# EAGLE design shematic (EAGLE 6.4)
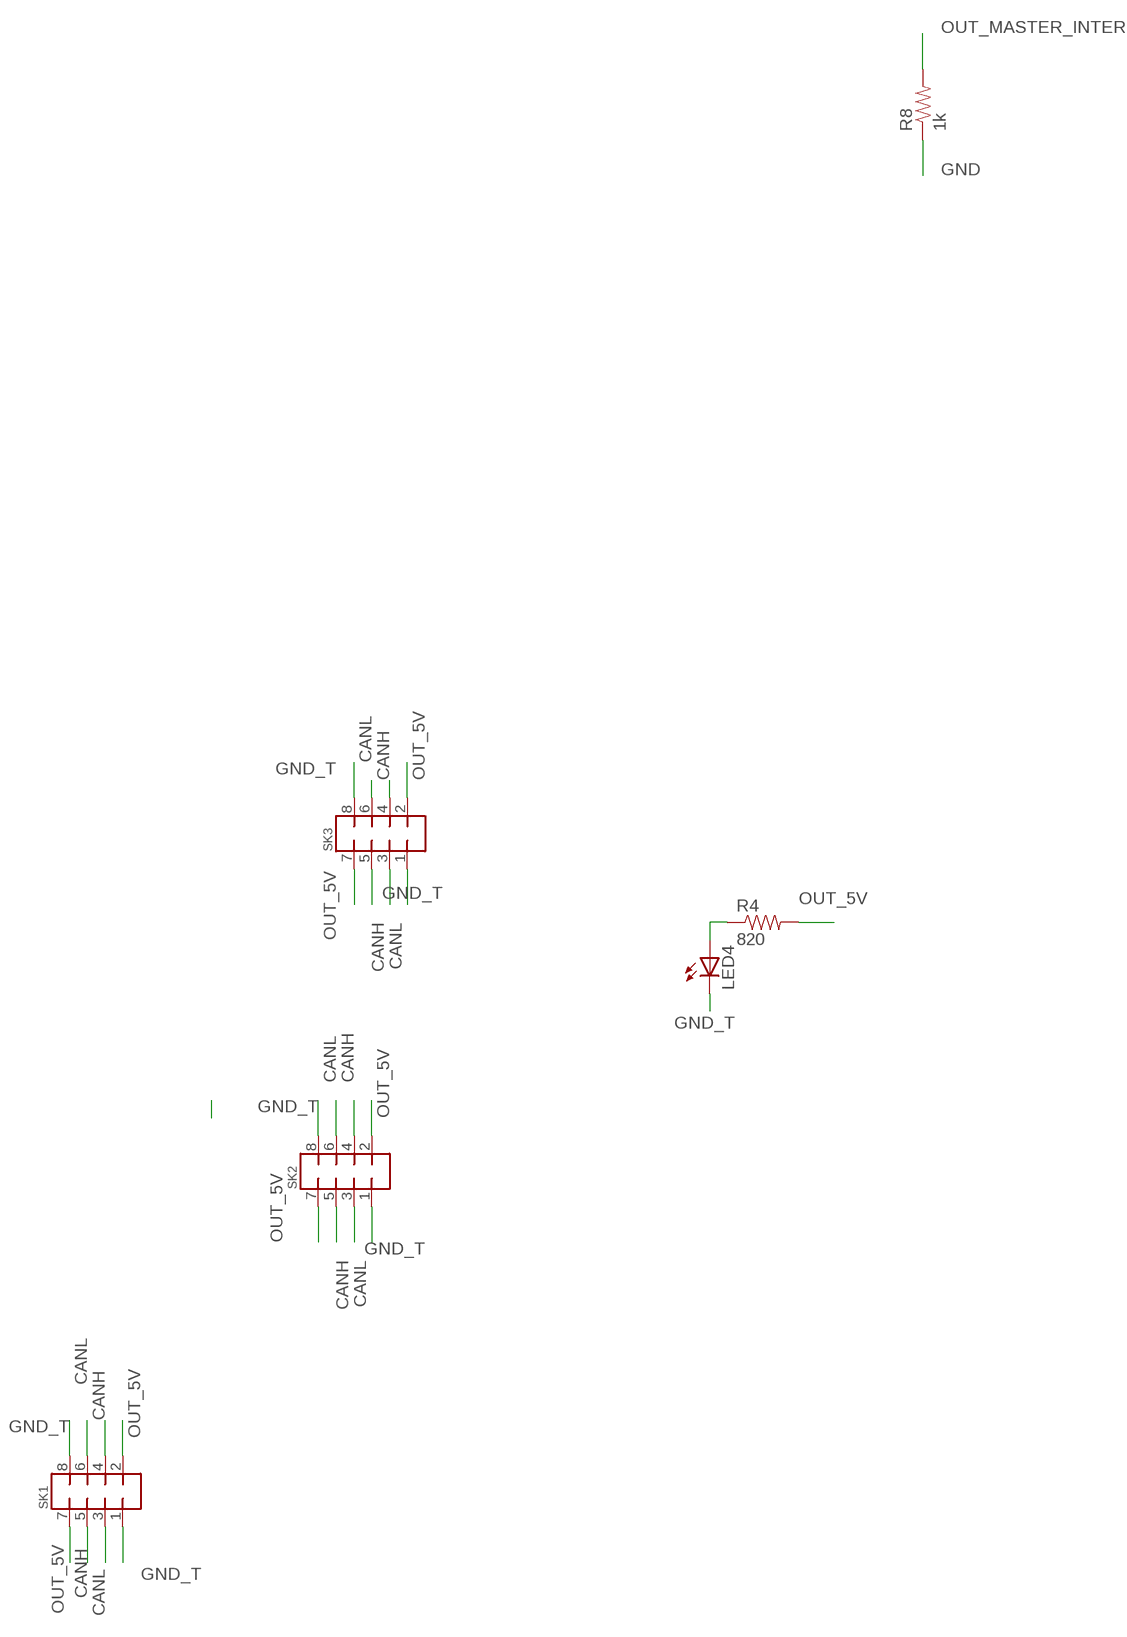
[diagram p0: schematic, sheet 1, part 1 of 2]
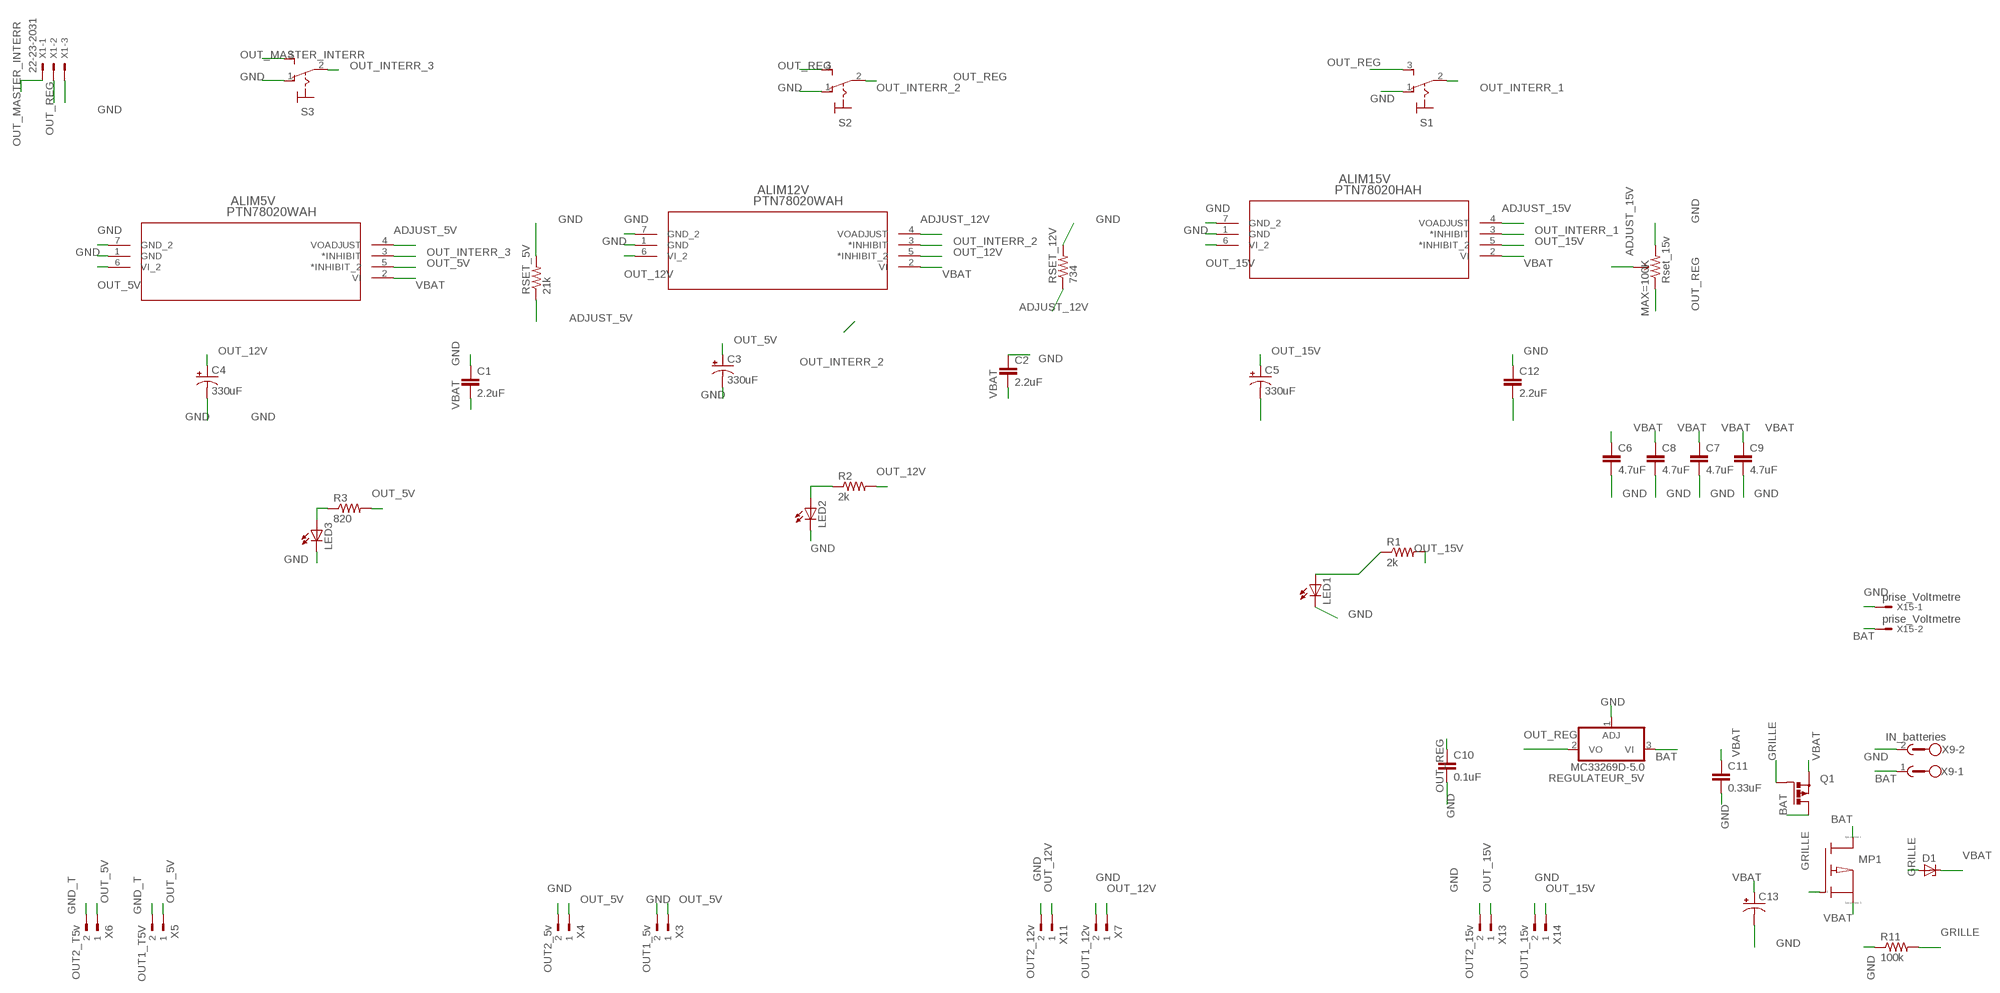
[diagram p1: schematic, sheet 1, part 2 of 2]

## Parts
ALIM5V  PTN78020WAH  PTN78020_  [EUK7]
ALIM12V  PTN78020WAH  PTN78020_  [EUK7]
ALIM15V  PTN78020HAH  PTN78020_  [EUK7]
C1  2.2uF  CAP0805  [0805]
C2  2.2uF  CAP0805  [0805]
C3  330uF  CAP_POLPTH1  [CPOL-RADIAL-100UF-25V]
C4  330uF  CAP_POLPTH1  [CPOL-RADIAL-100UF-25V]
C5  330uF  CAP_POLPTH1  [CPOL-RADIAL-100UF-25V]
C6  4.7uF  CAP0805  [0805]
C7  4.7uF  CAP0805  [0805]
C8  4.7uF  CAP0805  [0805]
C9  4.7uF  CAP0805  [0805]
C10  0.1uF  CAP0805  [0805]
C11  0.33uF  CAP0805  [0805]
C12  2.2uF  CAP0805  [0805]
C13  CAP_POLPTH1  [CPOL-RADIAL-100UF-25V]
D1  ZENER-DIODESOT23  [SOT23]
LED1  LEDCHIP-LED0805  [CHIP-LED0805]
LED2  LEDCHIP-LED0805  [CHIP-LED0805]
LED3  LEDCHIP-LED0805  [CHIP-LED0805]
LED4  LEDCHIP-LED0805  [CHIP-LED0805]
MAX=100K  Rset_15v  TRIMPOT-PTH-KNOB  [3386U]
MP1  PMOS  [SOT23]
Q1  PMOSFET_PTO220BH  [TO220BH]
R1  2k  RESISTOR0805-RES  [0805]
R2  2k  RESISTOR0805-RES  [0805]
R3  820  RESISTOR0805-RES  [0805]
R4  820  RESISTOR0805-RES  [0805]
R8  1k  RESISTOR0805-RES  [0805]
R11  100k  RESISTOR0805-RES  [0805]
REGULATEUR_5V  MC33269D-5.0  [DPACK]
RSET_5V  21k  RESISTOR0805-RES  [0805]
RSET_12V  734  RESISTOR0805-RES  [0805]
S1  M9040P  [M9040P]
S2  M9040P  [M9040P]
S3  M9040P  [M9040P]
SK1  MMATCH-8-PTH  [AMP-215079-8]
SK2  MMATCH-8-PTH  [AMP-215079-8]
SK3  MMATCH-8-PTH  [AMP-215079-8]
X1  22-23-2031  [22-23-2031]
X3  OUT1_5v  90-2  [90-2]
X4  OUT2_5v  90-2  [90-2]
X5  OUT1_T5V  90-2  [90-2]
X6  OUT2_T5v  90-2  [90-2]
X7  OUT1_12v  90-2  [90-2]
X9  IN_batteries  GMSTBA2  [GMSTBA2]
X11  OUT2_12v  90-2  [90-2]
X13  OUT2_15v  90-2  [90-2]
X14  OUT1_15v  90-2  [90-2]
X15  prise_Voltmetre  KK-156-2  [KK-156-2]

## Nets
ADJUST_5V: ALIM5V.4(VOADJUST) RSET_5V.1
ADJUST_12V: ALIM12V.4(VOADJUST) RSET_12V.1
ADJUST_15V: ALIM15V.4(VOADJUST) MAX=100K.2(WIPER)
BAT: MP1.3(D) Q1.D REGULATEUR_5V.3(VI) X9.1 X15.2
CANH: SK1.4 SK1.5 SK2.4 SK2.5 SK3.4 SK3.5
CANL: SK1.3 SK1.6 SK2.3 SK2.6 SK3.3 SK3.6
GND: ALIM5V.1(GND) ALIM5V.7(GND_2) ALIM12V.1(GND) ALIM12V.7(GND_2) ALIM15V.1(GND) ALIM15V.7(GND_2) C1.1 C2.1 C3.2(-) C4.2(-) C5.2(-) C6.2 C7.2 C8.2 C9.2 C10.2 C11.2 C12.1 C13.2(-) LED1.C LED2.C LED3.C MAX=100K.3(CW) R8.1 R11.1 REGULATEUR_5V.1(ADJ) RSET_5V.2 RSET_12V.2 S1.1(O) S2.1(O) S3.1(O) X1.3 X3.2 X4.2 X7.2 X9.2 X11.2 X13.2 X14.2 X15.1
GND_T: LED4.C SK1.1 SK1.8 SK2.1 SK2.8 SK3.1 SK3.8 X5.2 X6.2
GRILLE: D1.1(A) MP1.1(G) Q1.G R11.2
N$2: LED1.A R1.1
N$3: LED2.A R2.1
N$4: LED3.A R3.1
N$5: LED4.A R4.1
OUT_5V: ALIM5V.5(*INHIBIT_2) ALIM5V.6(VI_2) C3.1(+) R3.2 R4.2 SK1.2 SK1.7 SK2.2 SK2.7 SK3.2 SK3.7 X3.1 X4.1 X5.1 X6.1
OUT_12V: ALIM12V.5(*INHIBIT_2) ALIM12V.6(VI_2) C4.1(+) R2.2 X7.1 X11.1
OUT_15V: ALIM15V.5(*INHIBIT_2) ALIM15V.6(VI_2) C5.1(+) R1.2 X13.1 X14.1
OUT_INTERR_1: ALIM15V.3(*INHIBIT) S1.2(P)
OUT_INTERR_2: ALIM12V.3(*INHIBIT) S2.2(P)
OUT_INTERR_3: ALIM5V.3(*INHIBIT) S3.2(P)
OUT_MASTER_INTERR: R8.2 S3.3(S) X1.1
OUT_REG: C10.1 MAX=100K.1(CCW) REGULATEUR_5V.2(VO) S1.3(S) S2.3(S) X1.2
VBAT: ALIM5V.2(VI) ALIM12V.2(VI) ALIM15V.2(VI) C1.2 C2.2 C6.1 C7.1 C8.1 C9.1 C11.1 C12.2 C13.1(+) D1.3(C) MP1.2(S) Q1.S

## Library data of the parts
ALIM5V ALIM12V ALIM15V = ptn78020_:PTN78020_
C1 C2 C6-C12 = SparkFun-Passives:CAP: Capacitor Standard 0603 ceramic capacitor, and 0.1" leaded capacitor.
C3-C5 = SparkFun-Capacitors:CAP_POL: Capacitor Polarized These are standard SMD and PTH capacitors. Normally 10uF, 47uF, and 100uF in electrolytic and tantalum varieties. Always verify the external diameter of the through hole cap, it varies with capacity, voltage, and manufacturer. The EIA devices should be standard.
C13 = SparkFun-Passives:CAP_POL: Capacitor Polarized These are standard SMD and PTH capacitors. Normally 10uF, 47uF, and 100uF in electrolytic and tantalum varieties. Always verify the external diameter of the through hole cap, it varies with capacity, voltage, and manufacturer. The EIA devices should be standard.
D1 = diode:ZENER-DIODE: Z-Diode
LED1-LED4 = adafruit:LED: LED OSRAM: - CHIPLED LG R971, LG N971, LY N971, LG Q971, LY Q971, LO R971, LY R971 LH N974, LH R974 LS Q976, LO Q976, LY Q976 LO Q996 - Hyper CHIPLED LW Q18S LB Q993, LB Q99A, LB R99A - SideLED LS A670, LO A670, LY A670, LG A670, LP A670 LB A673, LV A673, LT A673, LW A673 LH A674 LY A675 LS A676, LA A676, LO A676, LY A676, LW A676 LS A679, LY A679, LG A679 - Hyper Micro SIDELED® LS Y876, LA Y876, LO Y876, LY Y876 LT Y87S - SmartLED LW L88C, LW L88S LB L89C, LB L89S, LG L890 LS L89K, LO L89K, LY L89K LS L896, LA L896, LO L896, LY L896 - TOPLED LS T670, LO T670, LY T670, LG T670, LP T670 LSG T670, LSP T670, LSY T670, LOP T670, LYG T670 LG T671, LOG T671, LSG T671 LB T673, LV T673, LT T673, LW T673 LH T674 LS T676, LA T676, LO T676, LY T676, LB T676, LH T676, LSB T676, LW T676 LB T67C, LV T67C, LT T67C, LS T67K, LO T67K, LY T67K, LW E67C LS E67B, LA E67B, LO E67B, LY E67B, LB E67C, LV E67C, LT E67C LW T67C LS T679, LY T679, LG T679 LS T770, LO T770, LY T770, LG T770, LP T770 LB T773, LV T773, LT T773, LW T773 LH T774 LS E675, LA E675, LY E675, LS T675 LS T776, LA T776, LO T776, LY T776, LB T776 LHGB T686 LT T68C, LB T68C - Hyper Mini TOPLED® LB M676 - Mini TOPLED Santana® LG M470 LS M47K, LO M47K, LY M47K Source: http://www.osram.convergy.de/
MAX=100K = SparkFun-Electromechanical:TRIMPOT: Various small potentiometers for "set-and-forget" applications
MP1 = sym:PMOS: P-Channel MOSFET transistor
Q1 = transistor-power:PMOSFET_P: Power MOSFET P-Channel
R1-R4 R8 = SparkFun-Resistors:RESISTOR: Resistor Basic schematic elements and footprints for 0603, 1206, and PTH resistors.
R11 RSET_5V RSET_12V = SparkFun-Passives:RESISTOR: Resistor Basic schematic elements and footprints for 0603, 1206, and PTH resistors.
REGULATEUR_5V = linear:MC33269?*: Adjustable Output Low Dropout Voltage Regulator 800 mA Source: http://www.onsemi.com/pub/Collateral/MC33269-D.PDF
S1-S3 = switch:M9040P: TOGGLE SWITCH Marquardt
SK1-SK3 = jt-con-micromatch:MMATCH-8-*: AMP Micromatch 8-pin
X1 = con-molex:22-23-2031: .100" (2.54mm) Center Header - 3 Pin; MF: MOLEX; MPN: 22-23-2031; OC_FARNELL: 1462950; OC_NEWARK: 30C0862
X3-X7 X11 X13 X14 = con-weidmueller-sl35:90-2: WEIDMUELLER CLAMP CONNECTOR; OC_FARNELL: unknown; OC_NEWARK: unknown
X9 = con-phoenix-762:GMSTBA2: PHOENIX; MF: FARNELL; MPN: 1757242; OC_FARNELL: 3705171; OC_NEWARK: 71C4161
X15 = con-molex:KK-156-2: KK 156 HEADER Source: http://www.molex.com/pdm_docs/sd/026604100_sd.pdf; OC_FARNELL: unknown; OC_NEWARK: unknown

## Net classes
0 default: width 1.016 mm, drill 0.6 mm, clearance 0.3 mm
1 puissance: width 2.86 mm, drill 0.6 mm, clearance 2.86 mm to class 0, clearance 0.073 mm

## Board
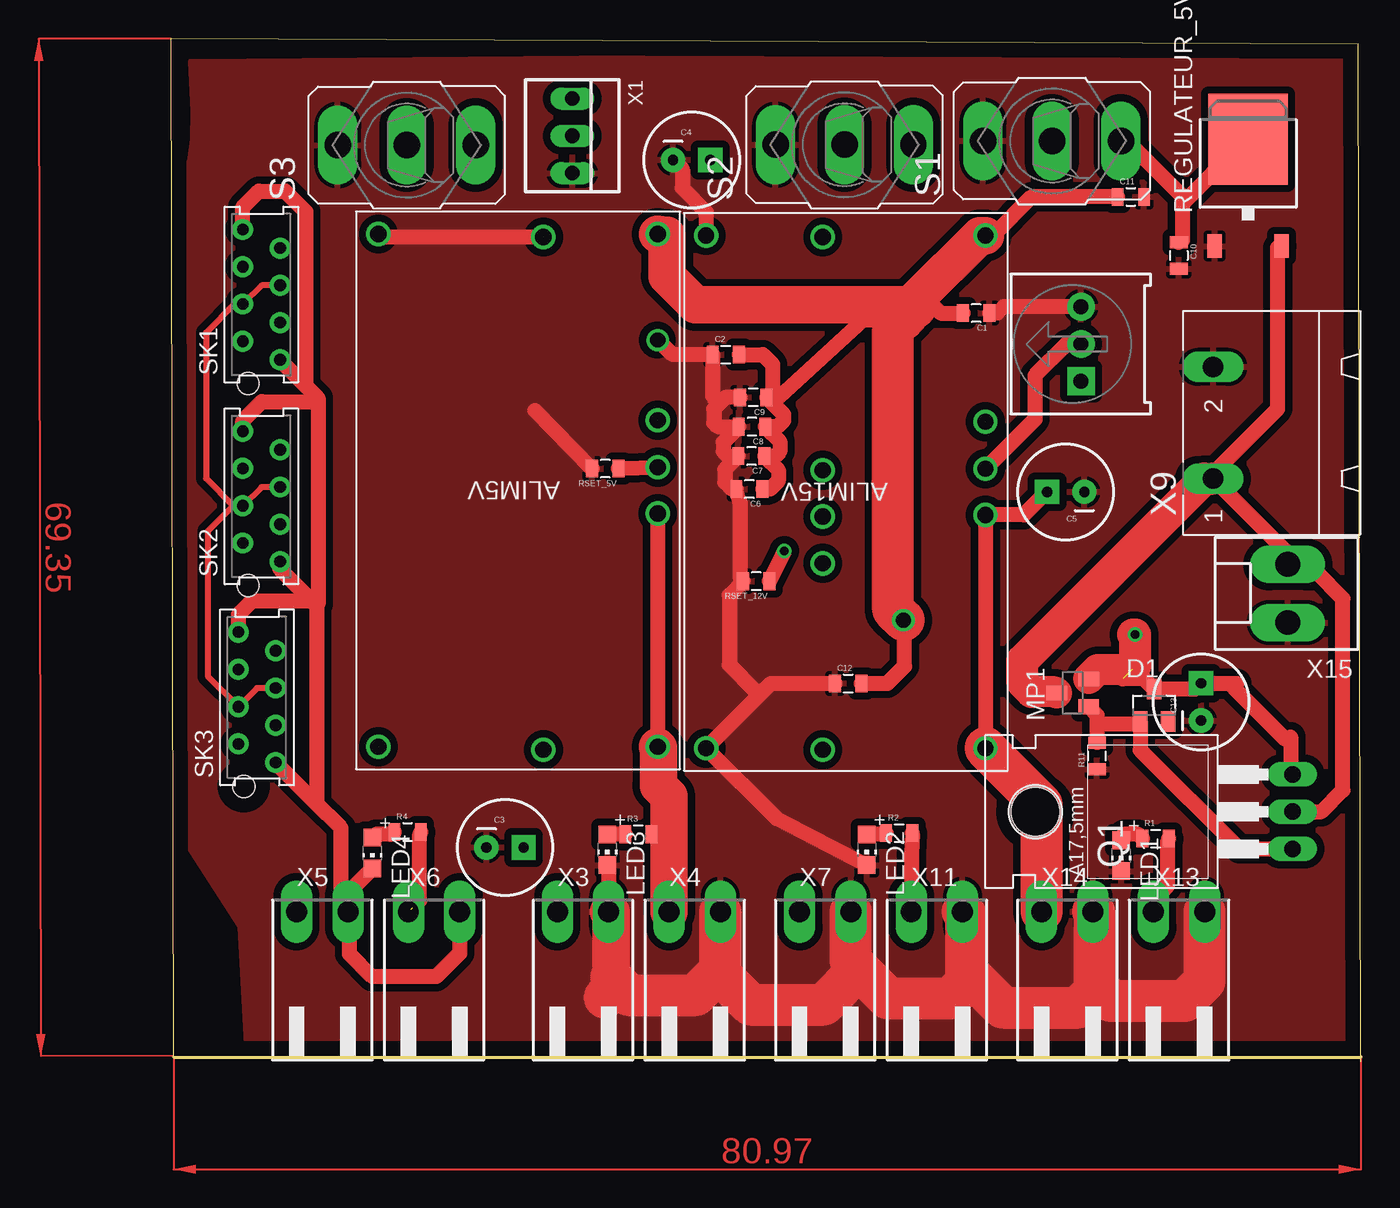
[diagram p2: board, top side]
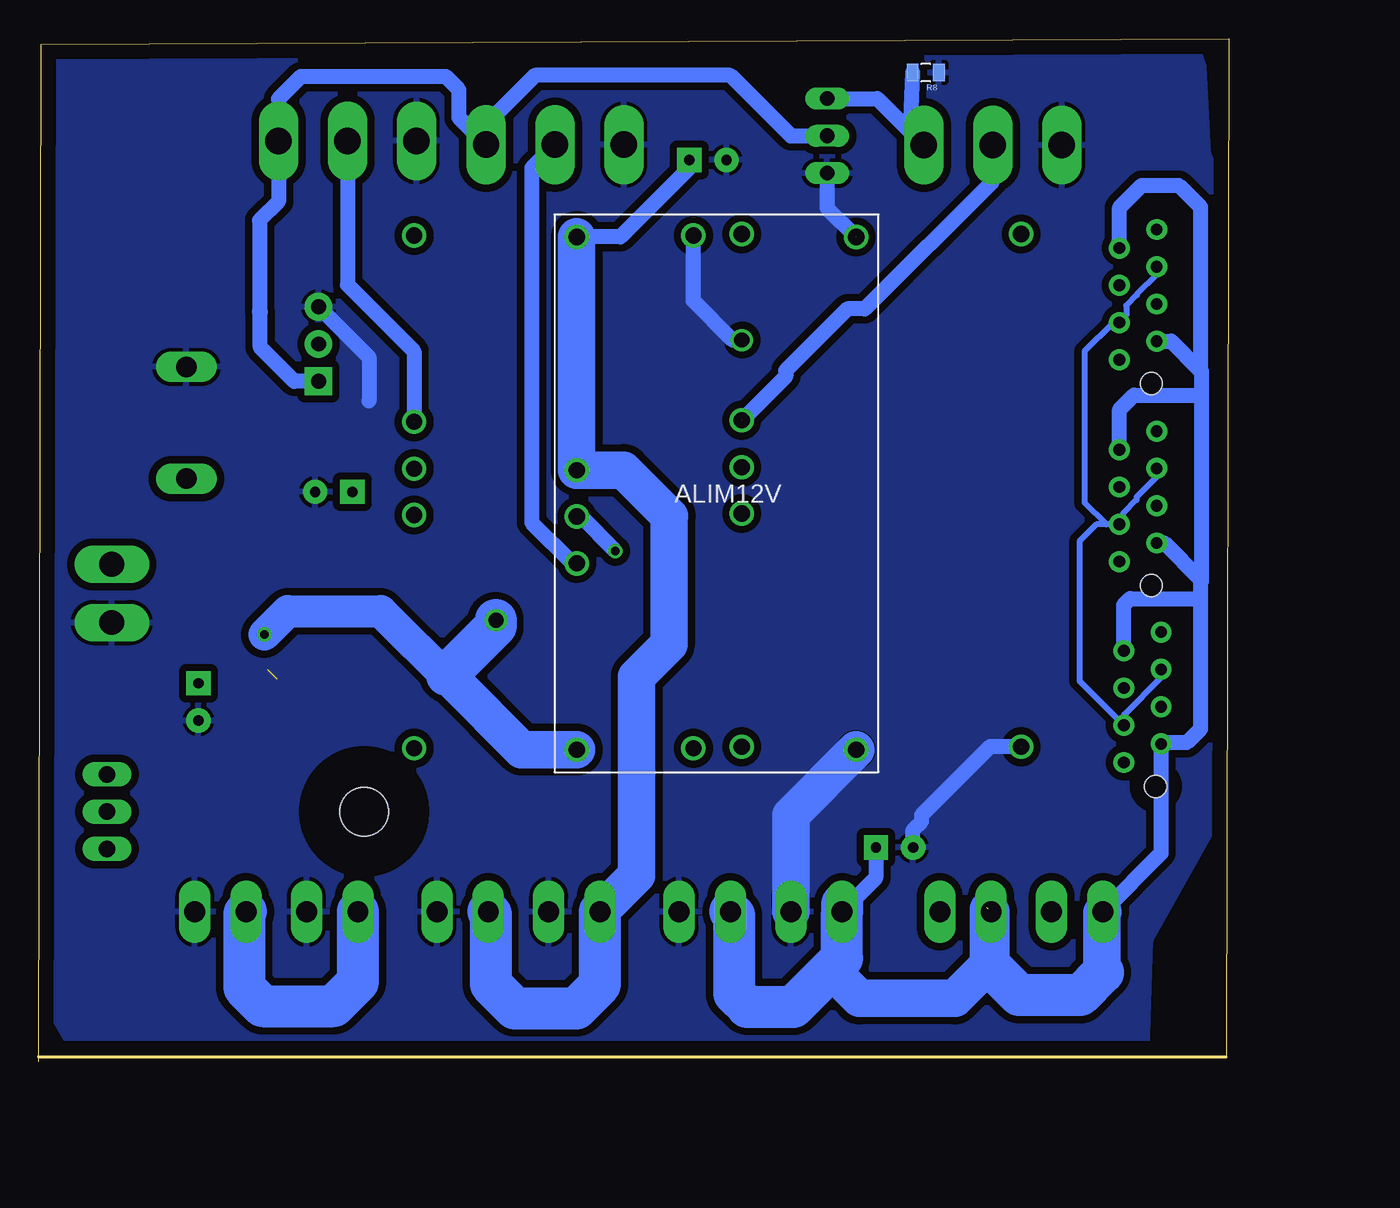
[diagram p3: board, bottom side, seen from below]

Size 81.15 x 69.75 mm. Coordinates in mm from the lower left corner, seen from the top.
Outline: 81.12,0 80.97,69.35 0,69.75 0.15,0.4
Outline: 0.17,0.33 81.15,0.33 81.15,0.35
Copper layers (1*16): Top 0.1mm / dielectric 1.5mm / Bottom 0.1mm
Design rules "ensea": minimum track width 0.5mm, minimum drill 0.5mm, track to track 0.5mm, track to pad 0.5mm, pad to pad 0.5mm, via to via 0.5mm, smd to smd 8mil, copper to edge 40mil, drill to drill 8mil, minimum pad ring 10mil, minimum via ring 8mil, stop-mask expansion 4mil, vias tented up to drill 0mil, thermal gap 10mil

### Footprints (pad centres in the part's own frame; a part is rotated, then mirrored left to right if it is on the bottom)
EUK7 = smd 1.016 x 1.016: 1 9.525,-17.475; 2 -9.525,-17.475; 3 -9.525,-4.775; 4 -9.525,-1.575; 5 -9.525,1.575; 6 -9.525,17.475; 7 9.525,17.475 | drill 1.1: P$1 -9.525,-17.475; P$2 -9.525,-4.775; P$3 -9.525,-1.575; P$4 -9.525,1.575; P$5 -9.525,17.475; P$6 9.525,17.475; P$7 9.525,-17.475
0805 = smd 0.8 x 1.2: 1 -0.9,0; 2 0.9,0
CPOL-RADIAL-100UF-25V = drill 0.7 pad 1.651 square: 1 1.27,0 | drill 0.7 pad 1.651: 2 -1.27,0
SOT23 = smd 1 x 1.4: 1 -0.95,-1.1; 2 0.95,-1.1; 3 0,1.1
CHIP-LED0805 = smd 1.2 x 1.2: A 0,-1.05; C 0,1.05
3386U = drill 1.016 pad 1.88 square: 1 -2.54,-0.015 | drill 1.016 pad 1.88: 2 0,-0.015; 3 2.54,-0.015
TO220BH = drill 1.118 long: D 0,-6.35; G -2.54,-6.35; S 2.54,-6.35 | hole 3.302: 0,11.176
DPACK = smd 1 x 1.6: 1 -2.28,-4.8; 3 2.28,-4.8 | smd 5.4 x 6.2: 2 0,2.5
M9040P = drill 1.803 long: 1 0,4.699; 2 0,0; 3 0,-4.699
AMP-215079-8 = drill 0.8 pad 1.422: 1 0,-1.27; 2 1.27,1.27; 3 2.54,-1.27; 4 3.81,1.27; 5 5.08,-1.27; 6 6.35,1.27; 7 7.62,-1.27; 8 8.89,1.27 | hole 1.5: -1.62,0.905
22-23-2031 = drill 1 long: 1 -2.54,0; 2 0,0; 3 2.54,0
90-2 = drill 1.422 long: 1 -1.75,5.25; 2 1.75,5.25
GMSTBA2 = drill 1.397 long: 1 -3.81,5.08; 2 3.81,5.08
KK-156-2 = drill 1.7 pad 2.184 long: 1 -1.98,0; 2 1.98,0

### Placement (x,y rotation side)
ALIM5V  23.68,38.95 180 top
ALIM12V  34.93,38.75 0 bottom
ALIM15V  46.02,38.85 180 top
C1  54.91,51.04 180 top
C2  37.84,48.21 0 top
C3  22.79,14.61 0 top
C4  35.52,61.48 0 top
C5  61.02,38.85 180 top
C6  39.45,39.04 180 top
C7  39.59,41.29 180 top
C8  39.62,43.29 180 top
C9  39.72,45.29 180 top
C10  68.73,54.97 270 top
C11  65.45,58.96 0 top
C12  46.19,25.79 0 top
C13  70.25,24.53 90 top
D1  67.05,24.3 0 top
LED1  64.8,14.05 180 top
LED2  47.46,14.45 180 top
LED3  29.77,14.45 180 top
LED4  13.74,14.23 180 top
MAX=100K  62.04,48.93 90 top
MP1  61.49,25.15 90 top
Q1  70.12,17.05 90 top
R1  67.15,15.21 0 top
R2  49.66,15.59 0 top
R3  31.88,15.52 0 top
R4  16.15,15.66 0 top
R8  20.65,67.42 180 bottom
R11  63.15,20.85 90 top
REGULATEUR_5V  73.46,60.4 0 top
RSET_5V  29.62,40.44 180 top
RSET_12V  39.91,32.76 180 top
S1  60.09,62.77 90 top
S2  45.94,62.52 90 top
S3  16.09,62.49 90 top
SK1  6.17,47.85 90 top
SK2  6.17,34.1 90 top
SK3  5.87,20.4 90 top
X1  27.38,63.12 270 top
X3  28.11,4.98 0 top
X4  35.73,4.98 0 top
X5  10.33,4.98 0 top
X6  17.95,4.98 0 top
X7  44.62,4.98 0 top
X9  76.15,43.56 90 top
X11  52.24,4.98 0 top
X13  68.74,4.98 0 top
X14  61.13,4.98 0 top
X15  76.15,31.92 90 top

### Tracks (layer width: path | path; a pad name or v marks a point on that pad's centre or on a via)
ADJUST_5V
  Top 1.016: RSET_5V.1 30.66,40.48 ALIM5V.4
ADJUST_12V  (via drill 0.6)
  Top 1.016: RSET_12V.1 v41.83,34.83
  Bottom 0.406: 44.18,37.17 ALIM12V.4
  Bottom 1.016: v41.83,34.83 44.18,37.17
ADJUST_15V
  Top 1.016: MAX=100K.2 61.05,48.93 58.93,46.8 58.93,43.8 ALIM15V.4
BAT
  Top 1.016: Q1.D 78.47,17.05 79.92,18.5 79.92,31.58 78.12,33.38 76.68,33.38 X15.2 76.15,34.67 X9.1 71.47,40.5 75.47,44.5 75.47,55.5 REGULATEUR_5V.3
  Top 2.1: MP1.3 60.31,25.23 58.7,25.23
  Top 2.18: 58.7,25.23 58.05,25.88 58.05,27.35 70.45,39.76 X9.1
CANH
  Top 0.4: SK1.5 6.17,52.93 SK1.4 4.36,51.66 2.4,49.7 2.4,39.77 4.26,37.91 | SK2.5 6.17,39.18 SK2.4 4.26,37.91 | SK3.5 5.87,25.48 SK3.4 2.53,26.29 2.53,36.17 4.26,37.91
CANL
  Bottom 0.4: SK1.6 4.9,53.7 6.25,52.35 6.25,52.27 6.97,51.55 6.97,50.86 SK1.3 7.86,50.39 9.83,48.42 9.83,38.12 8.35,36.64 | SK2.6 4.9,39.87 6.28,38.5 6.28,38.3 7.2,37.38 7.2,36.88 SK2.3 8.35,36.64 | SK3.6 4.6,26.2 7.12,23.68 7.12,22.96 SK3.3 10.17,25.97 10.17,35.48 9.01,36.64 8.35,36.64
GND  (via drill 1)  (2 unrouted)
  Top 1.016: 46.52,9.86 46.37,9.7 | C9.2 37.82,45.29 37.43,44.9 | 37.43,44.9 37.02,44.5 37.02,43.55 37.27,43.3 C8.2 37.68,42.24 37.68,41.6 37.98,41.29 C7.2 37.77,40.38 37.77,39.5 38.23,39.04 C6.2 38.82,38.11 38.82,33.01 RSET_12V.2 38.08,31.82 38.08,27.05 39.83,25.3 40.43,25.3 | 37.48,10.6 X4.2 | 40.43,25.3 ALIM15V.7 41.29,16.59 LED2.C | 40.43,25.3 40.91,25.79 C12.1 | RSET_5V.2 24.83,44.41 | MAX=100K.3 56.79,51.47 56.38,51.05 C1.1 | C4.2 34.88,60.85 34.88,59.55 36.5,57.92 ALIM15V.1 | 37.43,44.9 36.95,45.38 C2.1 34.22,48.21 v33.23,49.2 | ALIM5V.1 14.35,56.23 ALIM12V.7 | LED3.C 29.86,13.41 X3.2
  Top 2.56: X3.2 30.02,10.23 30.02,5.75
  Top 2.86: 30.02,5.75 30.48,5.3 | 30.48,5.3 31.23,4.55 35.77,4.55 37.48,6.25 X4.2 37.48,5.95 39.52,3.9 44.52,3.9 46.93,6.3 | X11.2 54.23,9.99 54.23,6.2 | 54.23,6.2 54.23,5.4 53.13,4.3 48.93,4.3 46.93,6.3 | 46.93,6.3 46.37,6.86 46.37,9.7 X7.2 | X14.2 62.98,10.13 62.98,5.3 63.23,5.05 | 63.23,5.05 64.12,4.15 69.12,4.15 70.49,5.52 X13.2 | 29.58,4.4 30.48,5.3 | 54.23,6.2 56.73,3.7 61.88,3.7 63.23,5.05
  Bottom 1.016: MAX=100K.3 58.63,48.03 58.63,45.05 | 62.18,38.96 C5.2 | v33.23,49.2 33.83,49.2 36.5,51.88 ALIM15V.1 | C3.2 21.52,15.81 20.93,16.4 20.93,16.82 16.25,21.5 14.17,21.5 ALIM5V.7 | 25.38,56.2 ALIM12V.7 27.38,58.2 X1.3
  Bottom 2.56: ALIM12V.1 29.86,16.82 X3.2
  pour Bottom (isolate 0.254): 1.67,67.85 1.92,68.53 80.45,69.25 80.25,3.2 79.1,1.2 26.12,1.05 22.48,1.1 19.27,0.8 5.92,0.65 5.58,0.78 5.33,8.25 0.32,17.18 0.3,25.05 0.42,34.25 0.53,38.1 0.42,56.25 0.3,59.95 1.03,61.17 1.37,61.92
  pour Top (isolate 0.305): 1.55,64.8 1.37,68.17 80.7,68.9 80.72,68.7 80.72,3.45 80.15,1.1 26.88,0.9 23.75,0.35 22.55,0.45 20.1,0.42 14.53,0.53 5.22,0.5 4.78,9.2 0.42,15.93 0.42,24.75 0.32,26.15 0.35,27.68 0.25,29.45 0.32,38.17 0.32,58.25 0.55,60.02 0.57,60.78 1.3,61.35 1.53,62.85
GND_T
  Top 1.016: 11.6,10.7 11.58,10.73 11.58,11.01 LED4.C | 11.6,10.7 X5.2 12.17,10.13 12.17,7.35 13.72,5.8 18.1,5.8 19.7,7.39 X6.2 | 11.6,10.7 11.6,15.94 9.85,17.7 | 9.85,17.7 SK3.1 | SK2.1 7.44,33.58 9.6,31.42 | 9.92,31.1 9.92,17.77 9.85,17.7 | SK1.1 7.44,47.83 9.2,46.08 | 9.2,46.08 9.97,45.3 | 9.97,45.3 10.03,45.25 10.03,31.2 9.92,31.1 | SK1.8 4.9,58.26 6,59.35 7.8,59.35 9.2,57.95 9.2,46.08 | SK2.8 4.9,43.7 6.2,45 9.67,45 9.97,45.3 | SK3.8 4.6,30.51 5.53,31.42 9.6,31.42 | 9.6,31.42 9.92,31.1
GRILLE
  Top 1.016: MP1.1 63.15,23.64 63.15,23.02 | 63.15,23.02 R11.2 | 63.15,23.02 65.92,23.02 D1.1 66.1,21.25 72.84,14.51 Q1.G
N$2
  Top 1.016: LED1.A 64.97,15.5 65.97,15.5 R1.1
N$3
  Top 1.016: LED2.A 47.48,15.5 48.48,15.5 R2.1
N$4
  Top 1.016: LED3.A 29.98,15.5 30.98,15.5 R3.1
N$5
  Top 1.016: 13.9,15.19 LED4.A 13.97,15.5 14.97,15.5 R4.1
N$7  (via drill 1)
  other vias: 49.93,30.1
N$16  (via drill 1)
  other vias: 33.18,49.2
OUT_5V  (via drill 0.6)  (1 unrouted)
  Top 0.2: R3.2 33.79,15.52 33.98,15.7
  Top 1.016: ALIM5V.5 ALIM5V.6 | v16.38,10.41 X6.1 | 16.48,10.5 16.98,11 16.98,15.5 R4.2
  Top 2.56: ALIM5V.6 33.25,21.43 33.25,18.82 33.98,18.1 33.98,15.7 X4.1
  Bottom 0.8: 8.47,11.5 8.58,11.4
  Bottom 1.016: C3.1 24.05,12.53 X3.1 | 8.58,11.4 X5.1 4.6,14.2 SK3.2 4.53,21.75 2.85,21.75 1.92,22.68 1.92,31.5 | SK2.2 4.4,35.37 1.92,32.9 1.92,32.7 | 1.92,32.7 1.92,31.5 | SK1.2 3.92,49.12 2.05,47.25 | 2.05,47.25 1.85,47.05 1.85,45.33 | 1.85,45.33 1.85,32.77 1.92,32.7 | SK1.7 7.44,58.23 5.92,59.75 3.4,59.75 1.92,58.27 1.92,47.38 2.05,47.25 | SK2.7 7.44,44.45 6.45,45.45 1.97,45.45 1.85,45.33 | SK3.7 7.15,31.16 6.72,31.58 2,31.58 1.92,31.5
  Bottom 2.56: 16.2,6.47 X6.1 | v16.38,10.41 16.38,6.62 18.68,4.33 25.18,4.33 27.14,6.29 | 8.64,6.04 8.64,10.17 X5.1
  Bottom 2.86: X4.1 33.73,9.98 33.73,4.65 32.83,3.75 29.68,3.75 27.14,6.29 26.36,7.07 X3.1 26.36,10.77 | 8.58,6.1 8.64,6.04 10.12,4.55 14.28,4.55 16.2,6.47
OUT_12V
  Top 1.016: 50.43,10.29 X11.1 50.49,14.17 R2.2
  Bottom 1.016: C4.1 36.79,60.92 41.48,56.23 ALIM12V.6
  Bottom 2.56: X7.1 40.38,12.72 40.38,26.25 38.18,28.45 38.18,37.15 38.12,37.2 41.25,40.33 ALIM12V.5 ALIM12V.6
  Bottom 2.86: X11.1 50.32,10.07 50.32,5.3 48.68,3.65 44.48,3.65 42.87,5.26 X7.1
OUT_15V
  Top 1.016: 66.99,11.27 X13.1 67.47,11.5 67.97,12 67.97,15 R1.2 | C5.1 58.17,37.27 ALIM15V.5 ALIM15V.6
  Top 2.86: ALIM15V.6 59.38,17.55 X14.1
  Bottom 2.86: X13.1 67.12,10.1 67.12,5.05 65.88,3.8 61.02,3.8 59.38,5.45 X14.1
OUT_INTERR_1  (1 unrouted)
  Bottom 1.016: S1.2 60.09,52.96 55.55,48.42 ALIM15V.3
OUT_INTERR_2
  Bottom 1.016: S2.2 47.52,60.92 47.52,36.75 44.75,33.98 ALIM12V.3
OUT_INTERR_3  (1 unrouted)
  Bottom 1.016: ALIM5V.3 30.2,46.73 30.2,47.12 26,51.33 24.8,51.33 16.09,60.04 S3.2
OUT_MASTER_INTERR
  Bottom 1.016: X1.1 23.96,65.67 S3.3 21.73,63.43 R8.2
OUT_REG
  Top 1.016: 68.97,58.5 68.97,56 C10.1 | 68.97,58.5 72.97,62.5 REGULATEUR_5V.2 | 68.97,58.5 68.97,59 64.97,63 S1.3
  Bottom 1.016: MAX=100K.1 63.71,46.39 66.02,48.7 66.02,51.1 66.07,51.15 66.07,57.35 64.78,58.64 S1.3 64.78,65.64 63.27,67.15 53.38,67.15 52.48,66.25 52.48,64.36 S2.3 50.32,62.82 50.32,64.22 47.3,67.25 33.98,67.25 29.85,63.12 X1.2
VBAT  (via drill 0.6, 1)  (1 unrouted)
  Top 1.016: 48.88,49.55 49.25,49.92 49.73,50.4 49.73,50.6 | C11.1 58.68,58.96 56.05,56.33 ALIM15V.2 | 41.49,45.32 C9.1 41.77,44.13 41.77,43.7 41.37,43.29 C8.1 41.52,42.29 41.52,41.6 41.22,41.29 C7.1 41.43,40.35 41.43,39.6 40.87,39.04 C6.1 | 41.49,45.32 47.23,50.6 49.73,50.6 | 49.73,50.6 49.93,50.6 | C12.2 48.87,25.79 50.02,26.95 50.02,30.05 v49.98,30.1 | C2.2 40.37,48.21 41.02,47.55 41.02,45.79 41.49,45.32 | 50.75,51.42 50.75,51.6 50.75,51.92 50.8,51.98 51.18,52.35 52.49,51.04 C1.2 | 64.9,26.1 66.35,26.1 D1.3 69.85,25.4 C13.1 72.47,25.8 | 72.47,25.8 72.7,25.8 | 76.35,22.15 76.35,22 | 76.35,22 76.35,19.71 Q1.S | 76.35,22 75.97,22 72.47,25.5 72.47,25.8
  Top 2: MP1.2 62.59,26.14
  Top 2.1: 62.59,26.14 63.2,26.75 65.55,26.75 65.75,26.95
  Top 2.18: 65.61,29.12 v65.75,29.12 65.75,26.95
  Top 2.56: ALIM5V.2 33.83,56.35 33.83,53.55 35.77,51.6 50.75,51.6 | ALIM15V.2 55.15,56.33 50.8,51.98
  Top 2.86: 50.75,51.42 49.93,50.6 | v49.98,30.1 49.25,30.83 49.25,49.92
  Bottom 2.18: v65.75,29.12 64.15,30.73 57.82,30.73 53.02,25.93 52.85,25.93
  Bottom 2.56: ALIM12V.2 48.2,21.27 52.85,25.93 53.3,26.38
  Bottom 2.86: 53.3,26.38 49.98,29.7 v49.98,30.1
(copper drawn outside any net)
  shapes: Top area x2